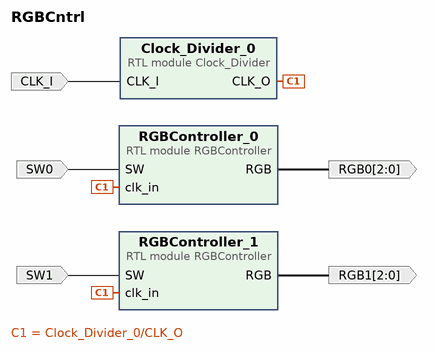
[diagram p0: block diagram of the top level]
# Vivado block design RGBCntrl, xc7z020clg400-1, Vivado 2022.2
create_bd_design RGBCntrl

create_bd_port -dir I -type clk CLK_I
set_property -dict {CONFIG.FREQ_HZ 125000000} [get_bd_ports CLK_I]
create_bd_port -dir I SW0
create_bd_port -dir I SW1
create_bd_port -dir O -from 2 -to 0 RGB0
create_bd_port -dir O -from 2 -to 0 RGB1

create_bd_cell -type module -reference Clock_Divider Clock_Divider_0
set_property -dict {CONFIG.DIVISOR 0x7735940} [get_bd_cells Clock_Divider_0]
create_bd_cell -type module -reference RGBController RGBController_0
create_bd_cell -type module -reference RGBController RGBController_1

# ---- connections ----

connect_bd_net [get_bd_ports CLK_I] [get_bd_pins Clock_Divider_0/CLK_I]
connect_bd_net [get_bd_pins Clock_Divider_0/CLK_O] [get_bd_pins RGBController_0/clk_in] [get_bd_pins RGBController_1/clk_in]
connect_bd_net [get_bd_pins RGBController_0/RGB] [get_bd_ports RGB0]
connect_bd_net [get_bd_pins RGBController_1/RGB] [get_bd_ports RGB1]
connect_bd_net -net SW1_1 [get_bd_ports SW0] [get_bd_pins RGBController_0/SW]
connect_bd_net -net SW2_1 [get_bd_ports SW1] [get_bd_pins RGBController_1/SW]

validate_bd_design
save_bd_design
